# Altium schematic sheet Morpheus_LDO.SchDoc: LDO with Boost Converter
size Letter; CompanyName: Hello Inc.; DrawnBy: Dyke Shaffer; Organization: Hello Inc.; Revision: DVT; SheetNumber: 2; SheetTotal: 4
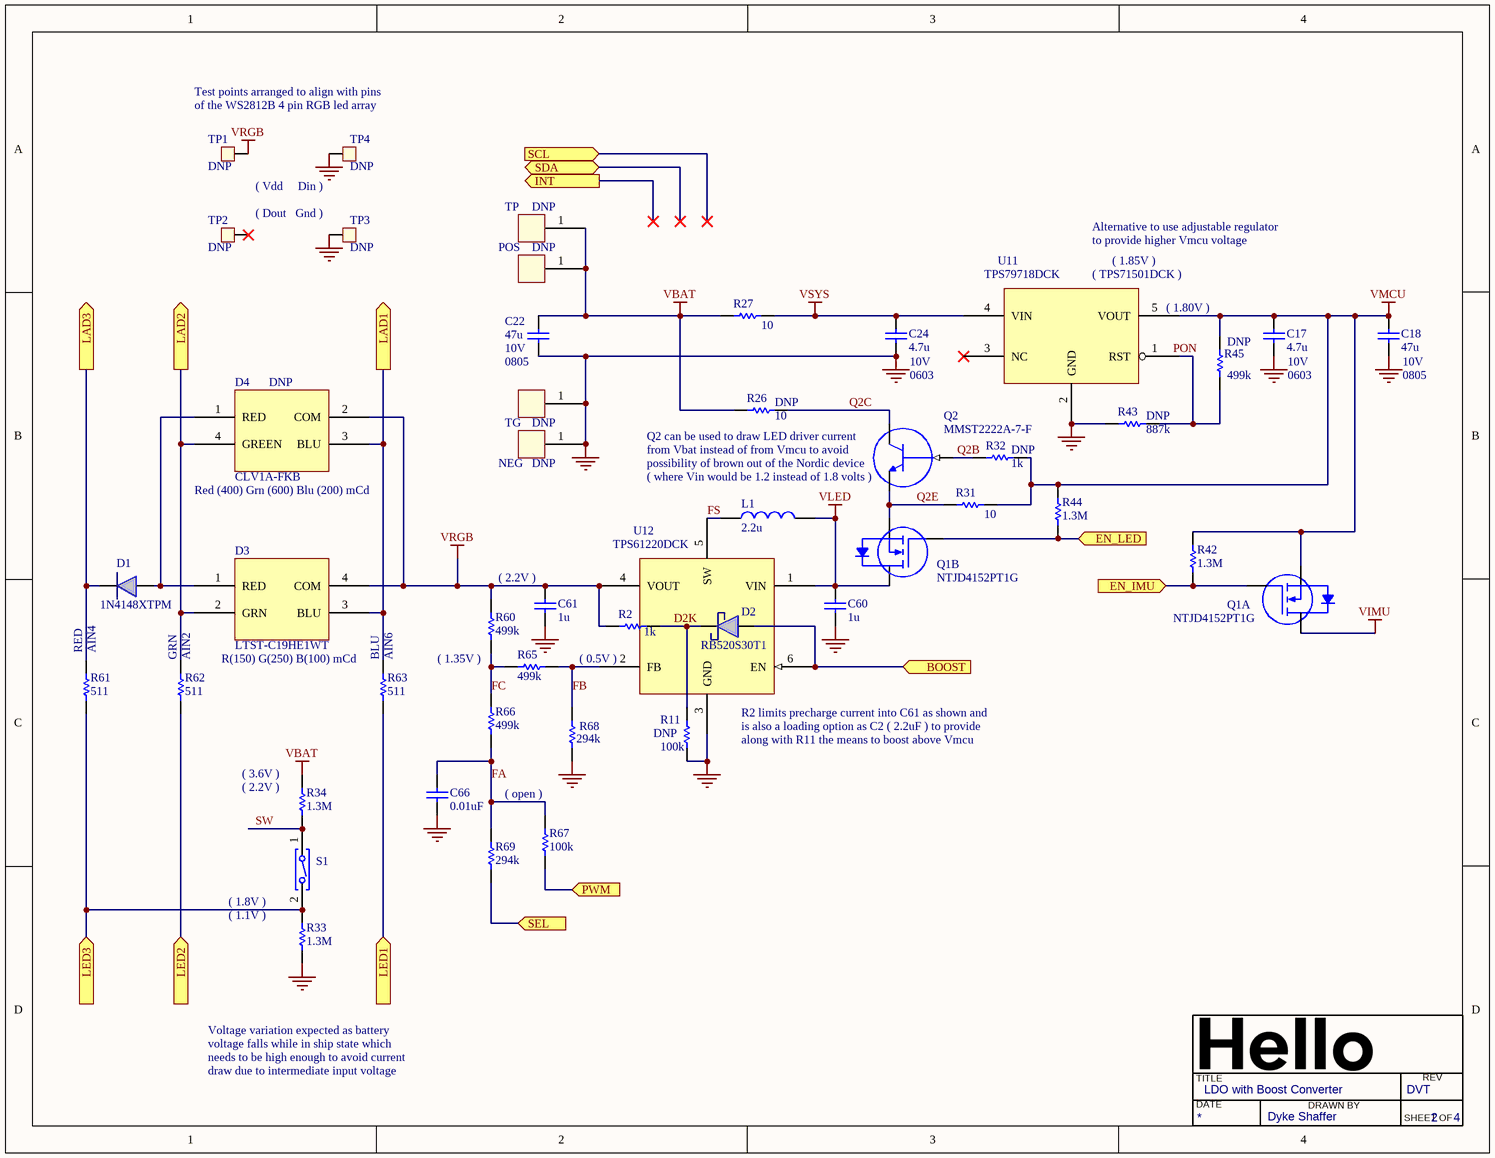
[diagram p0: Morpheus_LDO.SchDoc]

## Parts
C17  4.7u  Size: 0603  Voltage: 10V  [CAP0603_SENSE_DVT]
C18  47u  Size: 0805  Voltage: 10V  [CAP0805_SENSE_DVT]
C22  47u  Size: 0805  Voltage: 10V  [CAP0805_SENSE_DVT]
C24  4.7u  Size: 0603  Voltage: 10V  [CAP0603_SENSE_DVT]
C60  1u  [CAP0402_SENSE_DVT]
C61  1u  [CAP0402_SENSE_DVT]
C66  0.01uF  [CAP0402_SENSE_DVT]
D1  1N4148XTPM  [SOD523]
D2  RB520S30T1  [SOD523]
D3  LTST-C19HE1WT  value R(150) G(250) B(100) mCd  [DFN120X85P160X160X35-4R]
D4  DNP  value Red (400) Grn (600) Blu (200) mCd  [PLCC150X290P280X320X35-4]
L1  2.2u  [IND_1206]
NEG  DNP  [TP0875x050]
POS  DNP  [TP0875x050]
Q1  NTJD4152PT1G  [SOT65P212X110-6N]  (parts A,B of 2)
Q2  PN: MMST2222A-7-F  [SOT-323]  (hidden comment: MMST2222A)
R2  value 1k  [RES0402_SENSE_DVT]
R11  DNP  value 100k  [RES0402_SENSE_DVT]
R26  DNP  value 10  [RES0402_SENSE_DVT]
R27  10  [RES0402_SENSE_DVT]
R31  10  [RES0402_SENSE_DVT]
R32  DNP  value 1k  [RES0402_SENSE_DVT]
R33  1.3M  [RES0402_SENSE_DVT]
R34  1.3M  [RES0402_SENSE_DVT]
R42  1.3M  [RES0402_SENSE_DVT]
R43  DNP  value 887k  [RES0402_SENSE_DVT]
R44  1.3M  [RES0402_SENSE_DVT]
R45  DNP  value 499k  [RES0402_SENSE_DVT]
R60  499k  [RES0402_SENSE_DVT]
R61  511  [RES0402_SENSE_DVT]
R62  511  [RES0402_SENSE_DVT]
R63  511  [RES0402_SENSE_DVT]
R65  499k  [RES0402_SENSE_DVT]
R66  499k  [RES0402_SENSE_DVT]
R67  100k  [RES0402_SENSE_DVT]
R68  294k  [RES0402_SENSE_DVT]
R69  294k  [RES0402_SENSE_DVT]
S1  REED_SPST_NO  [REED-10x1.8]  (value not drawn)
TG  DNP  [TP0875x050]
TP  DNP  [TP0875x050]
TP1  DNP  [TP-0.8]
TP2  DNP  [TP-0.8]
TP3  DNP  [TP-0.8]
TP4  DNP  [TP-0.8]
U11  TPS79718DCK  [SOT65P212X110-5N]
U12  TPS61220DCK  [SOT65P212X110-6N]

## Ports
BOOST (in), EN_IMU (in), EN_LED (in), INT (out), LAD1 (out), LAD2 (out), LAD3 (out), LED1 (in), LED2 (in), LED3 (in), PWM (in), SCL (in), SDA, SEL (in)

## Nets
GND: C17.1 C18.1 C22.1 C24.1 C60.1 C61.1 C66.1 NEG.1 R11.1 R33.1 R43.1 R68.1 TG.1 TP3.1 TP4.1 U11.2(GND) U12.3(GND)
VBAT: C22.2 POS.1 R26.1 R27.1 R34.2 TP.1
VIMU: Q1.6(D1)
VLED: C60.2 L1.1 Q1.3(D2) U12.1(VIN)
VMCU: C17.2 C18.2 Q1.1(S1) R31.2 R32.2 R42.2 R44.2 R45.2 U11.5(VOUT)
VRGB: C61.2 D3.4(COM) D4.2(COM) R2.1 R60.2 TP1.1 U12.4(VOUT)
VSYS: C24.2 R27.2 U11.4(VIN)
BOOST: D2.2(Anode) U12.6(EN) ; port BOOST
D2K: D2.1(Cathode) R2.2 R11.2
EN_IMU: Q1.2(G1) R42.1 ; port EN_IMU
EN_LED: Q1.5(G2) R44.1 ; port EN_LED
FA: C66.2 R66.1 R67.2 R69.2
FB: R65.1 R68.2 U12.2(FB)
FC: R60.1 R65.2 R66.2
FS: L1.2 U12.5(SW)
LAD1: D3.3(BLU) D4.3(BLU) R63.2 ; port LAD1
LAD2: D3.2(GRN) D4.4(GREEN) R62.2 ; port LAD2
LAD3: D1.1(Cathode) R61.2 ; port LAD3
LED1: R63.1 ; port LED1
LED2: R62.1 ; port LED2
LED3: R33.2 R61.1 S1.2 ; port LED3
PWM: R67.1 ; port PWM
Q2B: Q2.1(IN) R32.1
Q2C: Q2.3(OUT) R26.2
Q2E: Q1.4(S2) Q2.2(GND) R31.1
SEL: R69.1 ; port SEL
SW: R34.1 S1.1
NetD1_2: D1.2(Anode) D3.1(RED) D4.1(RED)
NetR43_2: R43.2 R45.1 U11.1(RST)

Not connected (* = marked no-connect by the designer): TP2 1*; U11 3(NC)*

## Notes on the sheet
- Test points arranged to align with pins
- of the WS2812B 4 pin RGB led array
- ( Dout   Gnd )
- ( Vdd     Din )
- Alternative to use adjustable regulator
- (near U11) ( TPS71501DCK )
- to provide higher Vmcu voltage
- (near U11) ( 1.85V )
- ( 1.80V )
- (near Q2) Q2 can be used to draw LED driver current
- (near Q2) from Vbat instead of from Vmcu to avoid
- (near Q2) possibility of brown out of the Nordic device
- (near Q2) ( where Vin would be 1.2 instead of 1.8 volts )
- (near C61) ( 2.2V )
- (near R61) RED
- (near R61) AIN4
- (near R62) GRN
- (near R62) AIN2
- (near R63) BLU
- (near R63) AIN6
- (near R60) ( 1.35V )
- (near U12) ( 0.5V )
- (near R34) ( 3.6V )
- (near U12) R2 limits precharge current into C61 as shown and
- (near U12) is also a loading option as C2 ( 2.2uF ) to provide
- along with R11 the means to boost above Vmcu
- (near R34) ( 2.2V )
- ( open )
- ( 1.8V )
- ( 1.1V )
- Voltage variation expected as battery
- voltage falls while in ship state which
- needs to be high enough to avoid current
- draw due to intermediate input voltage
- Labels drawn without touching a wire or pin: PON
- TITLE
- DATE
- DRAWN BY
- REV
- SHEET
- OF

## Library data of the parts
C17 C24 = C_4.7u_20_10_X5R_0603: Chip capacitor; Vendor: TDK; PN: CGB3B1X5R1A475M055AC; Tolerance: 20%; Temp: X5R; Value: 4.7u
C18 C22 = C_47u_20_10_X5R_0805: Chip capacitor; Vendor: TDK; PN: C2012X5R1A476M125AC; Tolerance: 20%; Temp: X5R; Value: 47u
C60 C61 = C_1u_10_6.3_X5R_0402: Chip capacitor; Vendor: Taiyo Yuden; PN: JMK105BJ105KV-F; Tolerance: 10%; Voltage: 6.3V; Temp: X5R; Value: 1u; Size: 0402
C66 = C_10000p_10_50_X7R_0402: Chip capacitor; Value: 10000p; Vendor: Taiyo Yuden; PN: UMK105B7103KV-F; Tolerance: 10%; Voltage: 50; Temp: X7R; Size: 0402
D1 = 1N4148XTPM: Silicon diode, 30V 200mA; Vendor: ON Semi; PN: 1N4148XTPM
D2 = RB520S30T1: Schottky diode, 30V 200mA; Vendor: ON Semi; PN: RB520S30T1
D3 = LTST-C19HE1WT: RGB LED Array; Vendor: LiteOn; PN: LTST-C19HE1WT
D4 = CLV1A-FKB: RGB LED Array; Vendor: CREE; PN: CLV1A-FKB
L1 = L_2.2u_1206: SMD power inductor, 2.2uH; PN: LQM31PN2R2M00; Vendor: Murata; Tolerance: 20%; RDC: 0.19; I_max: 0.9; I_sat: 1.0; Value: 2.2u; Q: ?
NEG TG = 5016: Single-pad test point
POS TP = 5016: Single-pad test point; Value: TP0875x050
Q1 = NTJD4152PT1G: Vishay Dual N-Channel MOSFET 1.2v drive 20V 0.88A; Vendor: ON Semi; PN: NTJD4152PT1G
Q2 = MMST2222A: NPN Transistor, 20V, 600mA; Vendor: Diodes Inc
R2 R32 = R_1k_1_0.1_0402: Chip Resistor; Vendor: Panasonic; Tolerance: 1 %; Power: 0.1 W; PN: ERJ-2RKF1001X; Model: *; Size: 0402
R11 R67 = R_100k_1_0.1_0402: Chip Resistor; Vendor: Panasonic; Tolerance: 1 %; Power: 0.1 W; PN: ERJ-2RKF1003X; Model: *; Size: 0402
  R67: Value: 100k
R26 R27 R31 = R_10_1_0.1_0402: Chip Resistor; Vendor: Panasonic; Tolerance: 1 %; Power: 0.1 W; PN: ERJ-2RKF10R0X; Model: *; Size: 0402
  R27 R31: Value: 10
R33 R34 R42 R44 = R_1.3M_5_0.1_0402: Chip Resistor; Vendor: Panasonic; Tolerance: 5 %; Power: 0.1 W; PN: ERJ-2GEJ135X; Model: *; Value: 1.3M; Size: 0402
R43 = R_887k_1_0.1_0402: Chip Resistor; Vendor: Panasonic; Tolerance: 1 %; Power: 0.1 W; PN: ERJ-2RKF8873X; Model: *; Size: 0402
R45 R60 R65 R66 = R_499k_1_0.1_0402: Chip Resistor; Vendor: Panasonic; Tolerance: 1 %; Power: 0.1 W; PN: ERJ-2RKF4993X; Model: *; Size: 0402
  R60 R65 R66: Value: 499k
R61-R63 = R_511_1_0.1_0402: Chip Resistor; Vendor: Panasonic; Tolerance: 1 %; Power: 0.1 W; PN: ERJ-2RKF5110X; Model: *; Value: 511; Size: 0402
R68 R69 = R_294k_1_0.1_0402: Chip Resistor; Vendor: Panasonic; Tolerance: 1 %; Power: 0.1 W; PN: ERJ-2RKF2943X; Model: *; Value: 294k; Size: 0402
S1 = SW_REED_SPST_NO: SWITCH REED SPST NO; PN: ORD213-1015; Vendor: ORD
TP1-TP4 = TP-0.8: testpoint; PN: Test Point
U11 = TPS79718DCK: LDO 1.8V SC70-5; Vendor: TI; PN: TPS79718DCK
U12 = TPS61220: Boost Converter; Vendor: TI; PN: TPS61220DCK